# EAGLE design RoverWing-V2.0 (EAGLE 9.2.2)
Assembly variants: LCSC, DIGIKEY

## Sheet 1 of 2
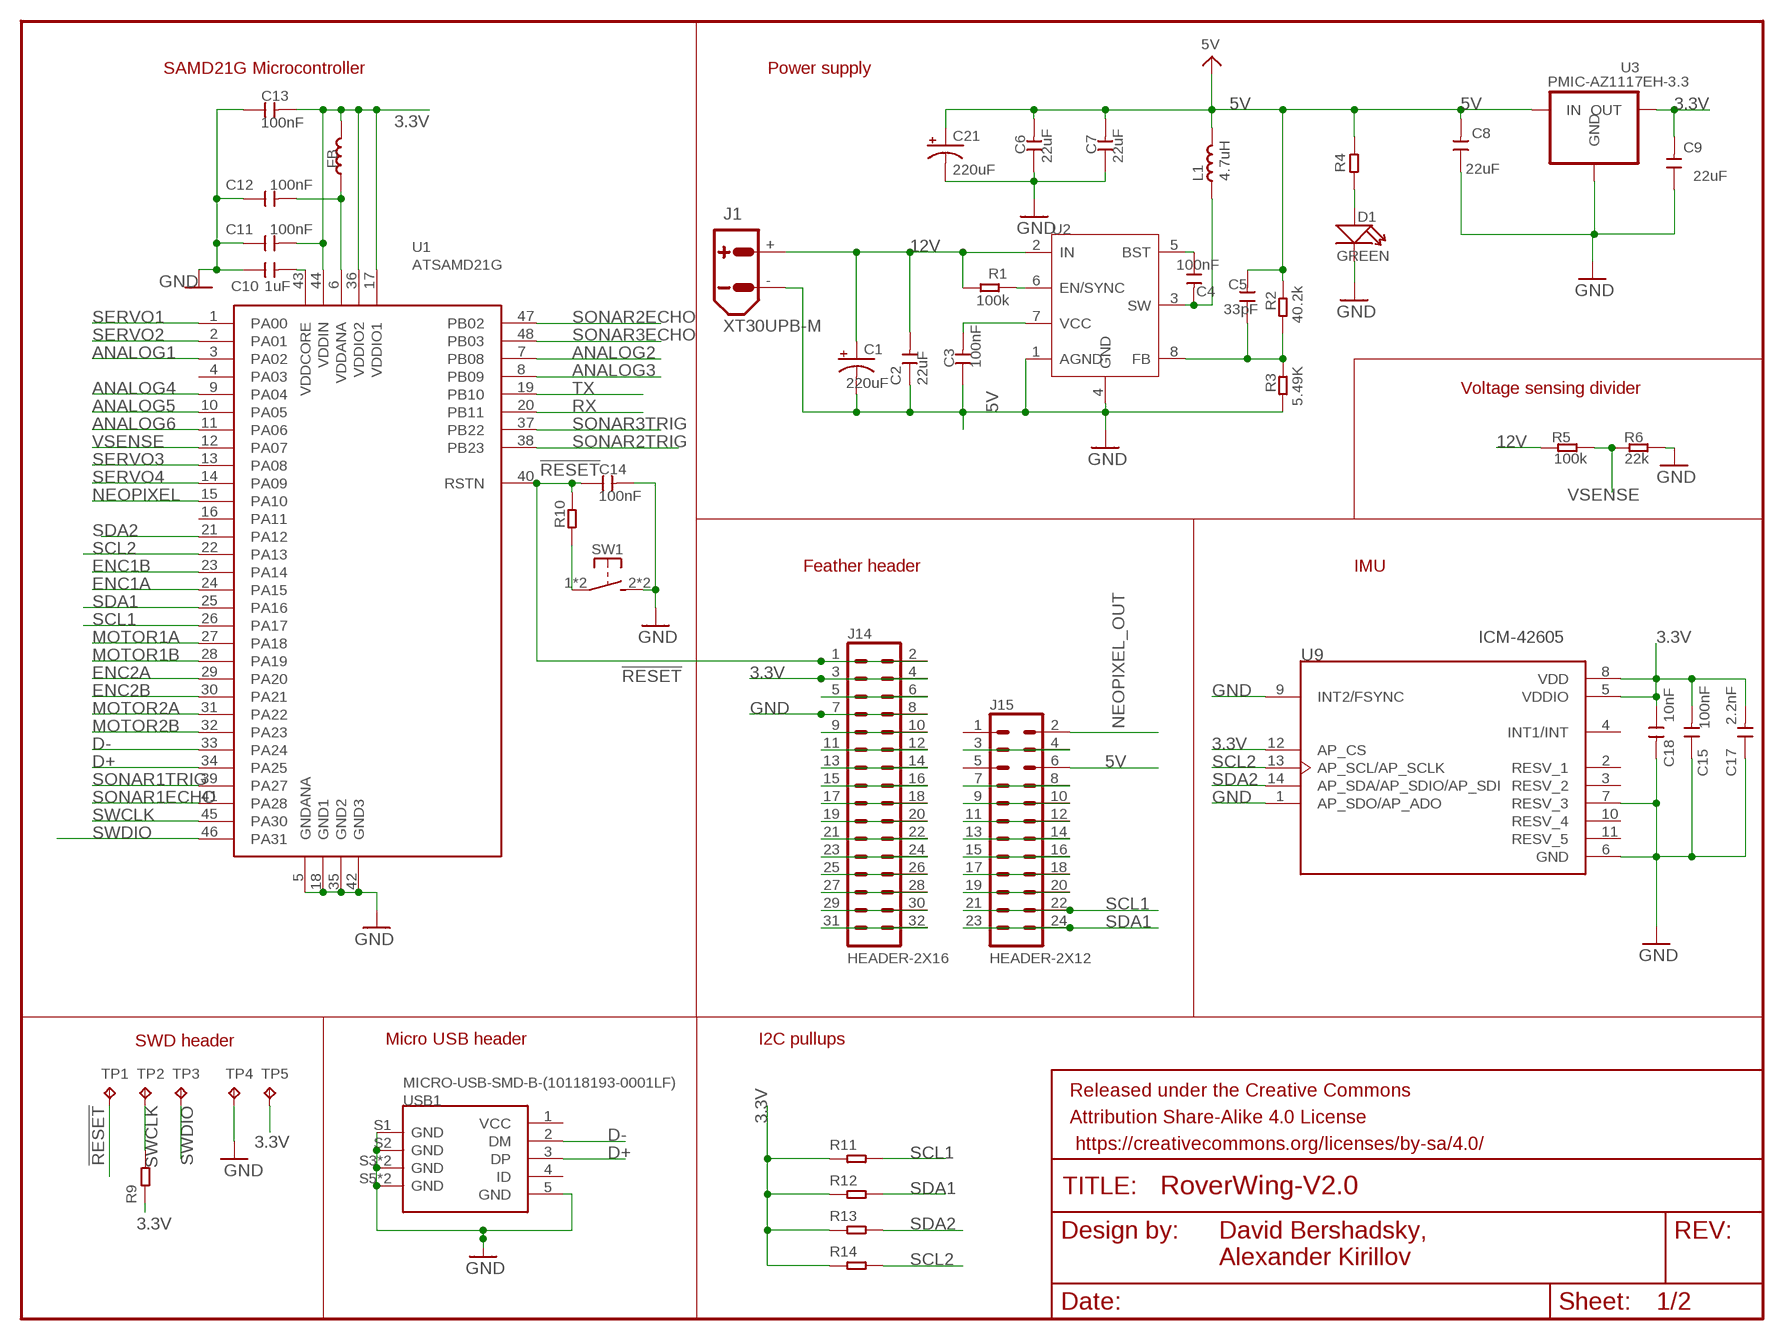
[diagram p0: schematic, sheet 1]

### Parts
C1  220uF  CAP-POL-SMD-8X10.5  [CAP-8X10.5]
C2  22uF  CAP-CERAMIC-SMD0805  [0805]
C3  100nF  CAP-CERAMIC-SMD0805  [0805]
C4  100nF  CAP-CERAMIC-SMD0805  [0805]
C5  33pF  CAP-CERAMIC-SMD0805  [0805]
C6  22uF  CAP-CERAMIC-SMD0805  [0805]
C7  22uF  CAP-CERAMIC-SMD0805  [0805]
C8  22uF  CAP-CERAMIC-SMD0805  [0805]
C9  22uF  CAP-CERAMIC-SMD0805  [0805]
C10  1uF  CAP-CERAMIC-SMD0805  [0805]
C11  100nF  CAP-CERAMIC-SMD0805  [0805]
C12  100nF  CAP-CERAMIC-SMD0805  [0805]
C13  100nF  CAP-CERAMIC-SMD0805  [0805]
C14  100nF  CAP-CERAMIC-SMD0805  [0805]
C15  100nF  CAP-CERAMIC-SMD0805  [0805]
C17  2.2nF  CAP-CERAMIC-SMD0805  [0805]
C18  10nF  CAP-CERAMIC-SMD0805  [0805]
C21  220uF  CAP-POL-SMD-8X10.5  [CAP-8X10.5]
D1  GREEN  SMD-LED-0805  [LED-0805]
FB  330R-1500MA  SMD-FERRITE-BEAD-330R-1500MA(0805)  [0805]
FRAME2  FRAME-LETTERNO_PACKAGE  [DUMMY]
J1  XT30UPB-M  [XT30UPB-M]
J14  HEADER-2X16  [2X16]
J15  HEADER-2X12  [2X12]
L1  4.7uH  IND-TDK-SPM6530T  [IND_TDK_7.1X6.5]
R1  100k  RES-SMD-0805  [0805]
R2  40.2k  RES-SMD-0805  [0805]
R3  5.49K  RES-SMD-0805  [0805]
R4  1K  SMD-RES-1.8K-1%-1/10W(0603)  [R0603]
R5  100k  RES-SMD-0805  [0805]
R6  22k  RES-SMD-0805  [0805]
R9  1K  SMD-RES-1.8K-1%-1/10W(0603)  [R0603]
R10  1K  SMD-RES-1.8K-1%-1/10W(0603)  [R0603]
R11  1.8K  SMD-RES-1.8K-1%-1/10W(0603)  [R0603]
R12  1.8K  SMD-RES-1.8K-1%-1/10W(0603)  [R0603]
R13  1.8K  SMD-RES-1.8K-1%-1/10W(0603)  [R0603]
R14  1.8K  SMD-RES-1.8K-1%-1/10W(0603)  [R0603]
SW1  SW-TACTILE-4.5X4.5_SMD  [TL3305]
TP1  TPTP15R  [TP15R]
TP2  TPTP15R  [TP15R]
TP3  TPTP15R  [TP15R]
TP4  TPTP15R  [TP15R]
TP5  TPTP15R  [TP15R]
U1  ATSAMD21G  [TQFP-48-EDITED]
U2  MP2225  PMIC-MP2225  [SOT-23-8]
U3  PMIC-AZ1117EH-3.3  [SOT223]
U9  ICM-42605  [PQFN50P300X250X97-14N]
USB1  MICRO-USB-SMD-B-(10118193-0001LF)  [MICRO-USB5+6P-SMD-0.65-B]

### Nets
3.3V: C9.2 C11.2 C13.2 C15.2 C17.2 C18.1 FB.2 J14.3 J14.4 R9.1 R11.1 R12.1 R13.1 R14.1 TP5.TP U1.17(VDDIO1) U1.36(VDDIO2) U1.44(VDDIN) U3.2(OUT) U3.4(OUT) U9.5(VDDIO) U9.8(VDD) U9.12(AP_CS) ; also sheet 2
5V: C5.2 C6.2 C7.2 C8.2 C21.+ J15.6 L1.2 R2.1 R4.2 U3.3(IN) ; also sheet 2
12V: C1.+ C2.2 J1.+ R1.2 R5.2 U2.2(IN) ; also sheet 2
!RESET: C14.1 J14.1 J14.2 R10.2 TP1.TP U1.40(RSTN)
ANALOG1: U1.3(PA02) ; also sheet 2
ANALOG2: U1.7(PB08) ; also sheet 2
ANALOG3: U1.8(PB09) ; also sheet 2
ANALOG4: U1.9(PA04) ; also sheet 2
ANALOG5: U1.10(PA05) ; also sheet 2
ANALOG6: U1.11(PA06) ; also sheet 2
BST: C4.1 U2.5(BST)
D+: U1.34(PA25) USB1.3(DP)
D-: U1.33(PA24) USB1.2(DM)
ENC1A: U1.24(PA15) ; also sheet 2
ENC1B: U1.23(PA14) ; also sheet 2
ENC2A: U1.29(PA20) ; also sheet 2
ENC2B: U1.30(PA21) ; also sheet 2
FB: C5.1 R2.2 R3.1 U2.8(FB)
GND: C1.- C2.1 C3.1 C6.1 C7.1 C8.1 C9.1 C10.1 C11.1 C12.1 C13.1 C14.2 C15.1 C17.1 C18.2 C21.- D1.- J1.- J14.7 J14.8 R3.2 R6.2 SW1.2(S1) SW1.3(S1) TP4.TP U1.5(GNDANA) U1.18(GND1) U1.35(GND2) U1.42(GND3) U2.1(AGND) U2.4(GND) U3.1(GND) U9.1(AP_SDO/AP_ADO) U9.6(GND) U9.7(RESV_3) U9.9(INT2/FSYNC) USB1.5(GND) USB1.S1(GND) USB1.S2(GND) USB1.S3(GND) USB1.S4(GND) USB1.S5(GND) USB1.S6(GND) ; also sheet 2
MOTOR1A: U1.27(PA18) ; also sheet 2
MOTOR1B: U1.28(PA19) ; also sheet 2
MOTOR2A: U1.31(PA22) ; also sheet 2
MOTOR2B: U1.32(PA23) ; also sheet 2
N$5: J15.3 J15.4
N$9: J15.7 J15.8
N$11: R10.1 SW1.1 SW1.4(P1)
N$12: J15.9 J15.10
N$14: C10.2 U1.43(VDDCORE)
N$15: J15.11 J15.12
N$17: D1.+ R4.1
N$18: J15.15 J15.16
N$22: J15.13 J15.14
N$23: R1.1 U2.6(EN/SYNC)
N$29: C3.2 U2.7(VCC)
N$42: J14.5 J14.6
N$45: J15.17 J15.18
N$46: J15.19 J15.20
N$48: J14.9 J14.10
N$49: J14.11 J14.12
N$50: J14.13 J14.14
N$51: J14.15 J14.16
N$52: J14.17 J14.18
N$53: J14.19 J14.20
N$54: J14.21 J14.22
N$55: J14.23 J14.24
N$56: J14.25 J14.26
N$57: J14.27 J14.28
N$58: J14.29 J14.30
N$59: J14.31 J14.32
NEOPIXEL: U1.15(PA10) ; also sheet 2
NEOPIXEL_OUT: J15.2 ; also sheet 2
RX: U1.20(PB11) ; also sheet 2
SCL1: J15.21 J15.22 R11.2 U1.26(PA17) ; also sheet 2
SCL2: R14.2 U1.22(PA13) U9.13(AP_SCL/AP_SCLK) ; also sheet 2
SDA1: J15.23 J15.24 R12.2 U1.25(PA16) ; also sheet 2
SDA2: R13.2 U1.21(PA12) U9.14(AP_SDA/AP_SDIO/AP_SDI) ; also sheet 2
SERVO1: U1.1(PA00) ; also sheet 2
SERVO2: U1.2(PA01) ; also sheet 2
SERVO3: U1.13(PA08) ; also sheet 2
SERVO4: U1.14(PA09) ; also sheet 2
SONAR1ECHO: U1.41(PA28) ; also sheet 2
SONAR1TRIG: U1.39(PA27) ; also sheet 2
SONAR2ECHO: U1.47(PB02) ; also sheet 2
SONAR2TRIG: U1.38(PB23) ; also sheet 2
SONAR3ECHO: U1.48(PB03) ; also sheet 2
SONAR3TRIG: U1.37(PB22) ; also sheet 2
SW: C4.2 L1.1 U2.3(SW)
SWCLK: R9.2 TP2.TP U1.45(PA30)
SWDIO: TP3.TP U1.46(PA31)
TX: U1.19(PB10) ; also sheet 2
VDDANA: C12.2 FB.1 U1.6(VDDANA)
VSENSE: R5.1 R6.1 U1.12(PA07)
Unconnected: J15.1 J15.5 U1.4(PA03) U1.16(PA11) U9.2(RESV_1) U9.3(RESV_2) U9.4(INT1/INT) U9.10(RESV_4) U9.11(RESV_5) USB1.1(VCC) USB1.4(ID)

### Notes on the sheet
- SAMD21G Microcontroller | Power supply
- Voltage sensing divider
- Feather header | IMU
- SWD header
- Micro USB header | I2C pullups
- David Bershadsky, 
  Alexander Kirillov

## Sheet 2 of 2
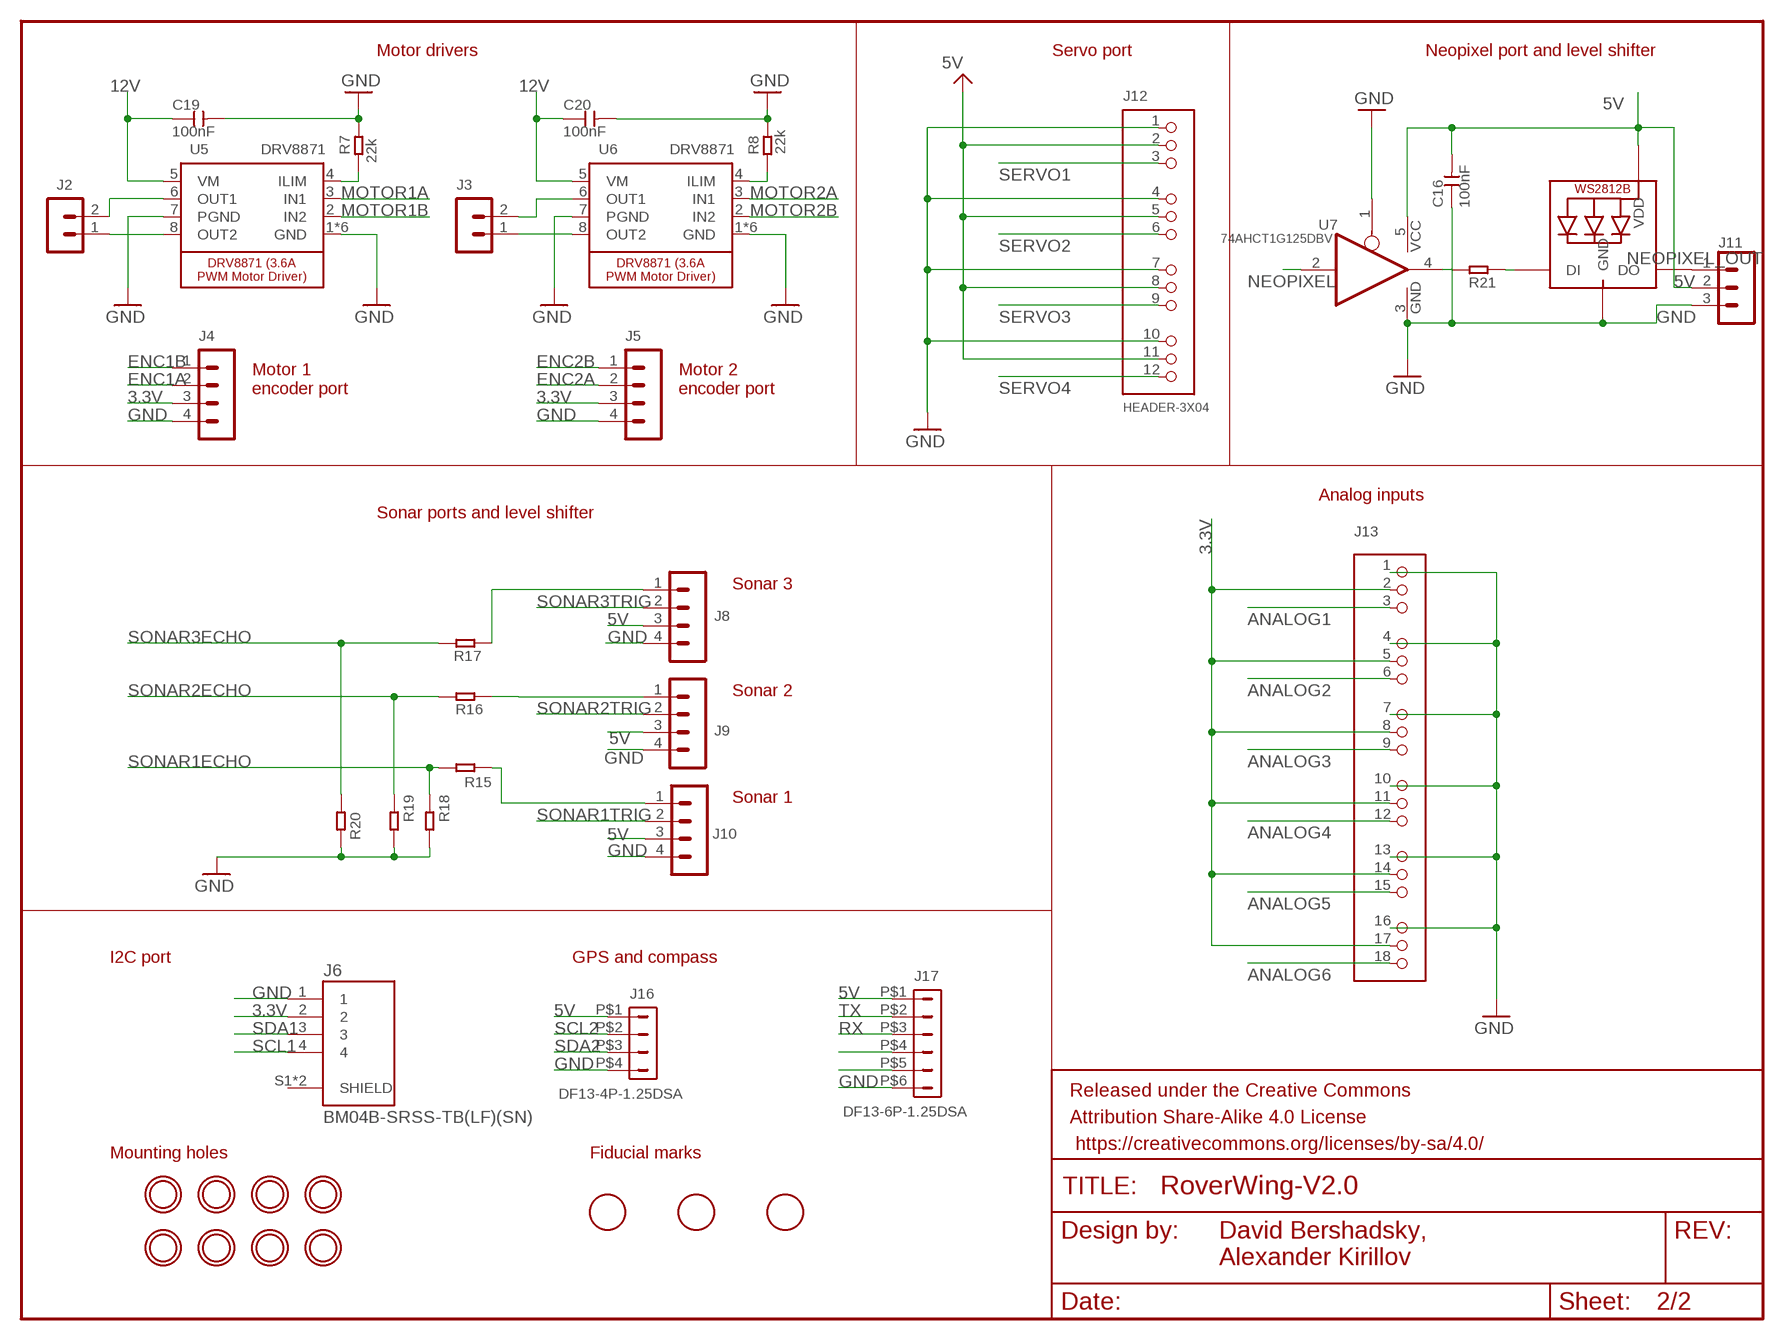
[diagram p1: schematic, sheet 2]

### Parts
C16  100nF  CAP-CERAMIC-SMD0805  [0805]
C19  100nF  CAP-CERAMIC-SMD0805  [0805]
C20  100nF  CAP-CERAMIC-SMD0805  [0805]
D2  WS2812B3535  [LED3535]
FRAME1  FRAME-LETTERNO_PACKAGE  [DUMMY]
J2  HEADER-VH  [B2P-VH]
J3  HEADER-VH  [B2P-VH]
J4  HEADER-PH-4P  [B4B-PH-K]
J5  HEADER-PH-4P  [B4B-PH-K]
J6  BM04B-SRSS-TB(LF)(SN)  [CONN_BM04B-SRSS-TB(LF)(SN)]
J8  HEADER-PH-4P  [B4B-PH-K]
J9  HEADER-PH-4P  [B4B-PH-K]
J10  HEADER-PH-4P  [B4B-PH-K]
J11  HEADER-PH-3P  [B3B-PH-K]
J12  HEADER-3X04  [3X04]
J13  HEADER-3X06"  [3X06]
J16  DF13-4P-1.25DSA  [DF13-4P-1.25DSA]
J17  DF13-6P-1.25DSA  [DF13-6P-1.25DSA]
R7  22k  RES-SMD-0805  [0805]
R8  22k  RES-SMD-0805  [0805]
R15  1K  SMD-RES-1.8K-1%-1/10W(0603)  [R0603]
R16  1K  SMD-RES-1.8K-1%-1/10W(0603)  [R0603]
R17  1K  SMD-RES-1.8K-1%-1/10W(0603)  [R0603]
R18  1.8K  SMD-RES-1.8K-1%-1/10W(0603)  [R0603]
R19  1.8K  SMD-RES-1.8K-1%-1/10W(0603)  [R0603]
R20  1.8K  SMD-RES-1.8K-1%-1/10W(0603)  [R0603]
R21  330  SMD-RES-1.8K-1%-1/10W(0603)  [R0603]
U5  DRV8871  [HSOP8]
U6  DRV8871  [HSOP8]
U7  74AHCT1G125DBV  [SOT23-5]
U$3  MOUNTINGHOLE3.0_NPH  [MOUNTINGHOLE_3.0_NPH]
U$4  MOUNTINGHOLE3.0_NPH  [MOUNTINGHOLE_3.0_NPH]
U$11  FIDUCIAL  [FIDUCIAL_1MM]
U$13  FIDUCIAL  [FIDUCIAL_1MM]
U$14  MOUNTINGHOLE3.0_NPH  [MOUNTINGHOLE_3.0_NPH]
U$15  MOUNTINGHOLE3.0_NPH  [MOUNTINGHOLE_3.0_NPH]
U$17  FIDUCIAL  [FIDUCIAL_1MM]
U$24  MOUNTINGHOLE3.0_NPH  [MOUNTINGHOLE_3.0_NPH]
U$25  MOUNTINGHOLE3.0_NPH  [MOUNTINGHOLE_3.0_NPH]
U$26  MOUNTINGHOLE3.0_NPH  [MOUNTINGHOLE_3.0_NPH]
U$27  MOUNTINGHOLE3.0_NPH  [MOUNTINGHOLE_3.0_NPH]

### Nets
3.3V: J4.3 J5.3 J6.2 J13.2 J13.5 J13.8 J13.11 J13.14 J13.17 ; also sheet 1
5V: C16.2 D2.3(VDD) J8.3 J9.3 J10.3 J11.2 J12.2 J12.5 J12.8 J12.11 J16.P$1 J17.P$1 U7.5(VCC) ; also sheet 1
12V: C19.1 C20.1 U5.5(VM) U6.5(VM) ; also sheet 1
ANALOG1: J13.3 ; also sheet 1
ANALOG2: J13.6 ; also sheet 1
ANALOG3: J13.9 ; also sheet 1
ANALOG4: J13.12 ; also sheet 1
ANALOG5: J13.15 ; also sheet 1
ANALOG6: J13.18 ; also sheet 1
ENC1A: J4.2 ; also sheet 1
ENC1B: J4.1 ; also sheet 1
ENC2A: J5.2 ; also sheet 1
ENC2B: J5.1 ; also sheet 1
GND: C16.1 C19.2 C20.2 D2.1(GND) J4.4 J5.4 J6.1 J8.4 J9.4 J10.4 J11.3 J12.1 J12.4 J12.7 J12.10 J13.1 J13.4 J13.7 J13.10 J13.13 J13.16 J16.P$4 J17.P$6 R7.2 R8.2 R18.2 R19.2 R20.2 U5.1(GND) U5.7(PGND) U5.GND U5.P$1(GND) U5.P$2(GND) U5.P$3(GND) U5.P$4(GND) U6.1(GND) U6.7(PGND) U6.GND U6.P$1(GND) U6.P$2(GND) U6.P$3(GND) U6.P$4(GND) U7.1(OE) U7.3(GND) ; also sheet 1
MOTOR1A: U5.3(IN1) ; also sheet 1
MOTOR1B: U5.2(IN2) ; also sheet 1
MOTOR2A: U6.3(IN1) ; also sheet 1
MOTOR2B: U6.2(IN2) ; also sheet 1
N$1: J3.1 U6.8(OUT2)
N$2: J3.2 U6.6(OUT1)
N$3: J2.1 U5.8(OUT2)
N$4: R21.2 U7.4(O)
N$6: D2.2(DI) R21.1
N$7: J10.1 R15.1
N$10: J8.1 R17.1
N$16: J2.2 U5.6(OUT1)
N$19: R7.1 U5.4(ILIM)
N$20: R8.1 U6.4(ILIM)
N$21: J9.1 R16.1
N$26: J17.P$4
N$27: J17.P$5
NEOPIXEL: U7.2(I) ; also sheet 1
NEOPIXEL_OUT: D2.4(DO) J11.1 ; also sheet 1
RX: J17.P$3 ; also sheet 1
SCL1: J6.4 ; also sheet 1
SCL2: J16.P$2 ; also sheet 1
SDA1: J6.3 ; also sheet 1
SDA2: J16.P$3 ; also sheet 1
SERVO1: J12.3 ; also sheet 1
SERVO2: J12.6 ; also sheet 1
SERVO3: J12.9 ; also sheet 1
SERVO4: J12.12 ; also sheet 1
SONAR1ECHO: R15.2 R18.1 ; also sheet 1
SONAR1TRIG: J10.2 ; also sheet 1
SONAR2ECHO: R16.2 R19.1 ; also sheet 1
SONAR2TRIG: J9.2 ; also sheet 1
SONAR3ECHO: R17.2 R20.1 ; also sheet 1
SONAR3TRIG: J8.2 ; also sheet 1
TX: J17.P$2 ; also sheet 1
Unconnected: J6.S1(SHIELD) J6.S2(SHIELD)

### Notes on the sheet
- Motor drivers | Servo port | Neopixel port and level shifter
- Motor 1
  encoder port
- Motor 2 
  encoder port
- Analog inputs
- Sonar ports and level shifter
- Sonar 3
- Sonar 2
- Sonar 1
- I2C port | GPS and compass
- Mounting holes | Fiducial marks
- David Bershadsky, 
  Alexander Kirillov

## Library data of the parts
C1 C21 = RoverWing-V1.5:CAP-POL-SMD-8X10.5: AL CAPACITOR, SMD 8x10.5 mm; MANUFACTURER: Semtech; PARTNO: CK1V221MCRF10
C2-C20 = RoverWing-V1.5:CAP-CERAMIC-SMD: CAP CERAMIC, SMD
D1 = RoverWing-V1.5:SMD-LED-0805: SMD LED, 0805; MANUFACTURER: LITE-ON; PARTNO: LTST-C170KGKT
D2 = RoverWing-V1.5:WS2812B: SMART LED, 3.5MM; MANUFACTURER: Worldsemi; PARTNO: WS2812B-3535
FB = RoverWing-V1.5:SMD-FERRITE-BEAD-330R-1500MA(0805): Ferrite Bead 330R, 1500 MA; MANUFACTURER: MURATA ELECTRONICS; PARTNO: BLM21PG331SN1D
FRAME1 FRAME2 = RoverWing-V1.5:FRAME-LETTER: Schematic Frame - Letter Standard 8.5x11 US Letter frame; BOM: EXCLUDE
J1 = RoverWing-V1.5:XT30: AMASS XT30 connector Store in Japan AMASS XT30 connector <https://szc.jp/ams-xt30>
J2 J3 = RoverWing-V1.5:HEADER-VH: HEADER - JST VH, 2P 3.96mm pitch; PARTNO: B2P-VH(LF)(SN)
J4 J5 J8-J10 = RoverWing-V1.5:HEADER-PH-4P: HEADER, JST PH, 4POS, THROUGH HOLE, STRAIGHT; MANUFACTURER: JST; PARTNO: B4B-PH-K-S(LF)(SN)
J6 = RoverWing-V1.5:BM04B-SRSS-TB(LF)(SN): HEADER, JST SH 4POS SMD STRAIGHT; MANUFACTURER: JST; PARTNO: BM04B-SRSS-TB_LF__SN_
J11 = RoverWing-V1.5:HEADER-PH-3P: HEADER, JST PH, 3POS, THROUGH HOLE, STRAIGHT; MANUFACTURER: JST; PARTNO: B3B-PH-K-S(LF)(SN)
J12 = RoverWing-V1.5:HEADER-3X04
J13 = RoverWing-V1.5:HEADER-3X06
J14 = RoverWing-V1.5:HEADER-2X16: HEADER - 2x16, 0.1" PITCH
J15 = RoverWing-V1.5:HEADER-2X12: HEADER, 2x12, 0.1" PITCH
J16 = RoverWing-V1.5:DF13-4P-1.25: DF13-4P 1.25mm Pitch Miniature Crimping Connector.; PARTNO: DF13-4P-1.25DSA
J17 = RoverWing-V1.5:DF13-6P-1.25: DF13-6P 1.25mm Pitch Miniature Crimping Connector.; PARTNO: DF13-6P-1.25DSA
L1 = RoverWing-V1.5:IND-TDK-SPM6530T: Power inductor, SMD, 4.7uH, 5.2A Manufacturer: TDK; MANUFACTURER: TDK; PARTNO: SPM6530T-4R7M
R1-R3 R5-R8 = RoverWing-V1.5:RES-SMD-0805
R4 R9-R21 = RoverWing-V1.5:SMD-RES-1.8K-1%-1/10W(0603): SMD RESISTOR, 0603
SW1 = RoverWing-V1.5:SW-TACTILE: Tactile Switche; MANUFACTURER: BRIGHT; PARTNO: TSA453G38-250
TP1-TP5 = RoverWing-V1.5:TP: Test pad; BOM: EXCLUDE
U1 = RoverWing-V1.5:ATSAMD21G: SAMD21G MCU ARM® Cortex®-M0+ SAM D21G Microcontroller by Microchip Technology Specs: 32 bits 48 Mhz frequency 256 KB flash memory, 32 KB RAM Package: TQFP48 MPN: ATSAMD21G18A-AU; MANUFACTURER: Microchip Technology; PARTNO: ATSAMD21G18A-AU
U2 = RoverWing-V1.5:PMIC-MP2225: MP2225 buck converter Manufacturer: Monolithic Power Systems Specs: Vin: 4.5-18 V Vout: up to 13.7 V Iout: up to 5A; MANUFACTURER: Monolithic Power Systems; PARTNO: MP2225GJ
U3 = RoverWing-V1.5:PMIC-AZ1117EH-*: LDO VOLTAGE REGULATOR; MANUFACTURER: DIODES INC; PARTNO: AZ1117EH-3.3TRG1
U5 U6 = RoverWing-V1.5:DRV8871: DRV8871 - 3.6A PWM Motor Driver; MANUFACTURER: TEXAS INSTRUMENTS; PARTNO: DRV8871DDAR; SIZE: HSOP8
U7 = RoverWing-V1.5:74*1G125: Single Bus Buffer Gate with 3-State Output; PARTNO: SN74AHCT1G125DBVR
U9 = RoverWing-V1.5:ICM-42605: Single-Interface MotionTracking device The ICM-42605 is a 6-axis MotionTracking device that combines a 3-axis gyroscope, and a 3-axis accelerometer in a small 2.5x3x0.91 mm (14-pin LGA) package. It also features a 2K-byte FIFO that can lower the traffic on the serial bus interface, and reduce power consumption by allowing the system processor to burst read sensor data and then go into a low-power mode.; MANUFACTURER: TDK InvenSense; PARTNO: ICM-42605
U$3 U$4 U$14 U$15 U$24-U$27 = RoverWing-V1.5:MOUNTINGHOLE: Mounting Hole For #2 screws (0.086"/2.18mm width, 0.094"/2.4mm hole) use 2.5mm; BOM: EXCLUDE
U$11 U$13 U$17 = RoverWing-V1.5:FIDUCIAL: For use by pick and place machines to calibrate the vision/machine, 1mm By microbuilder.eu; BOM: EXCLUDE
USB1 = RoverWing-V1.5:MICRO-USB-SMD-B-(10118193-0001LF): 320010003; MANUFACTURER: Amphenol ICC; PARTNO: 10118193-0001LF

## Net classes
1 thinpower: width 0.305 mm
2 thickpower: width 0.406 mm

## Board
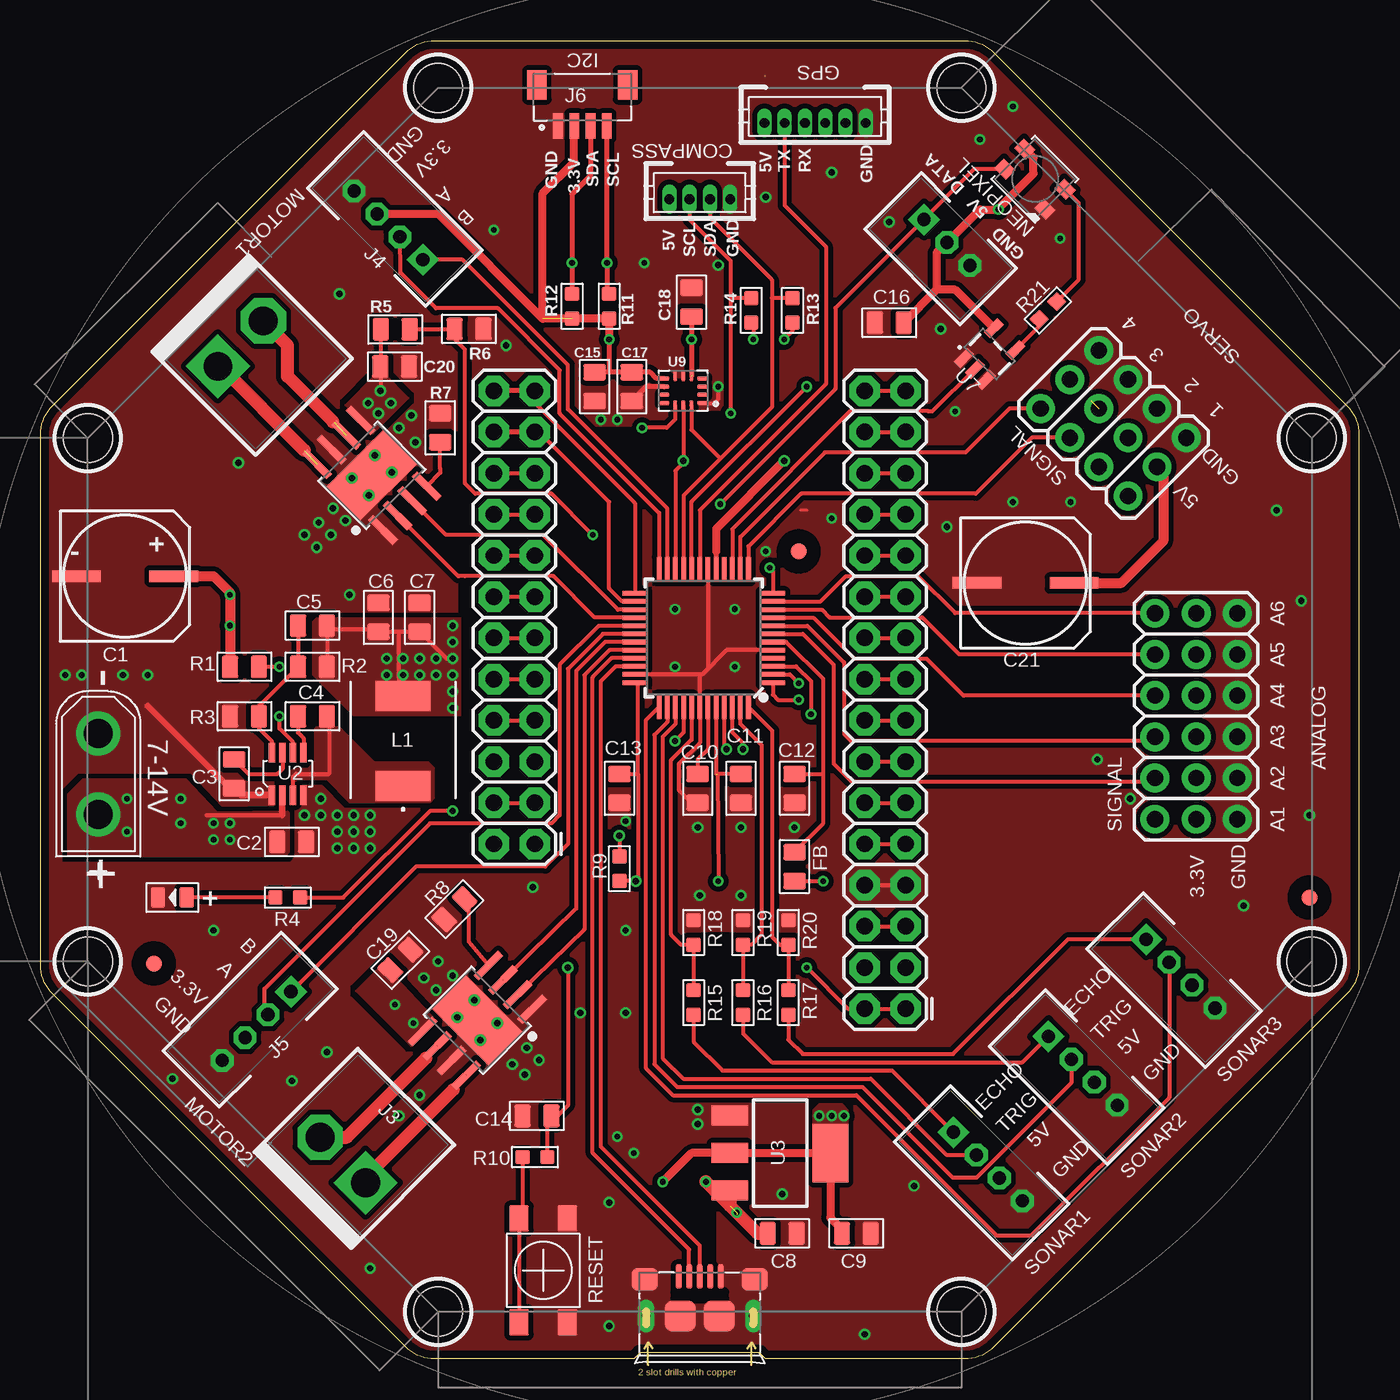
[diagram p2: board, top side]
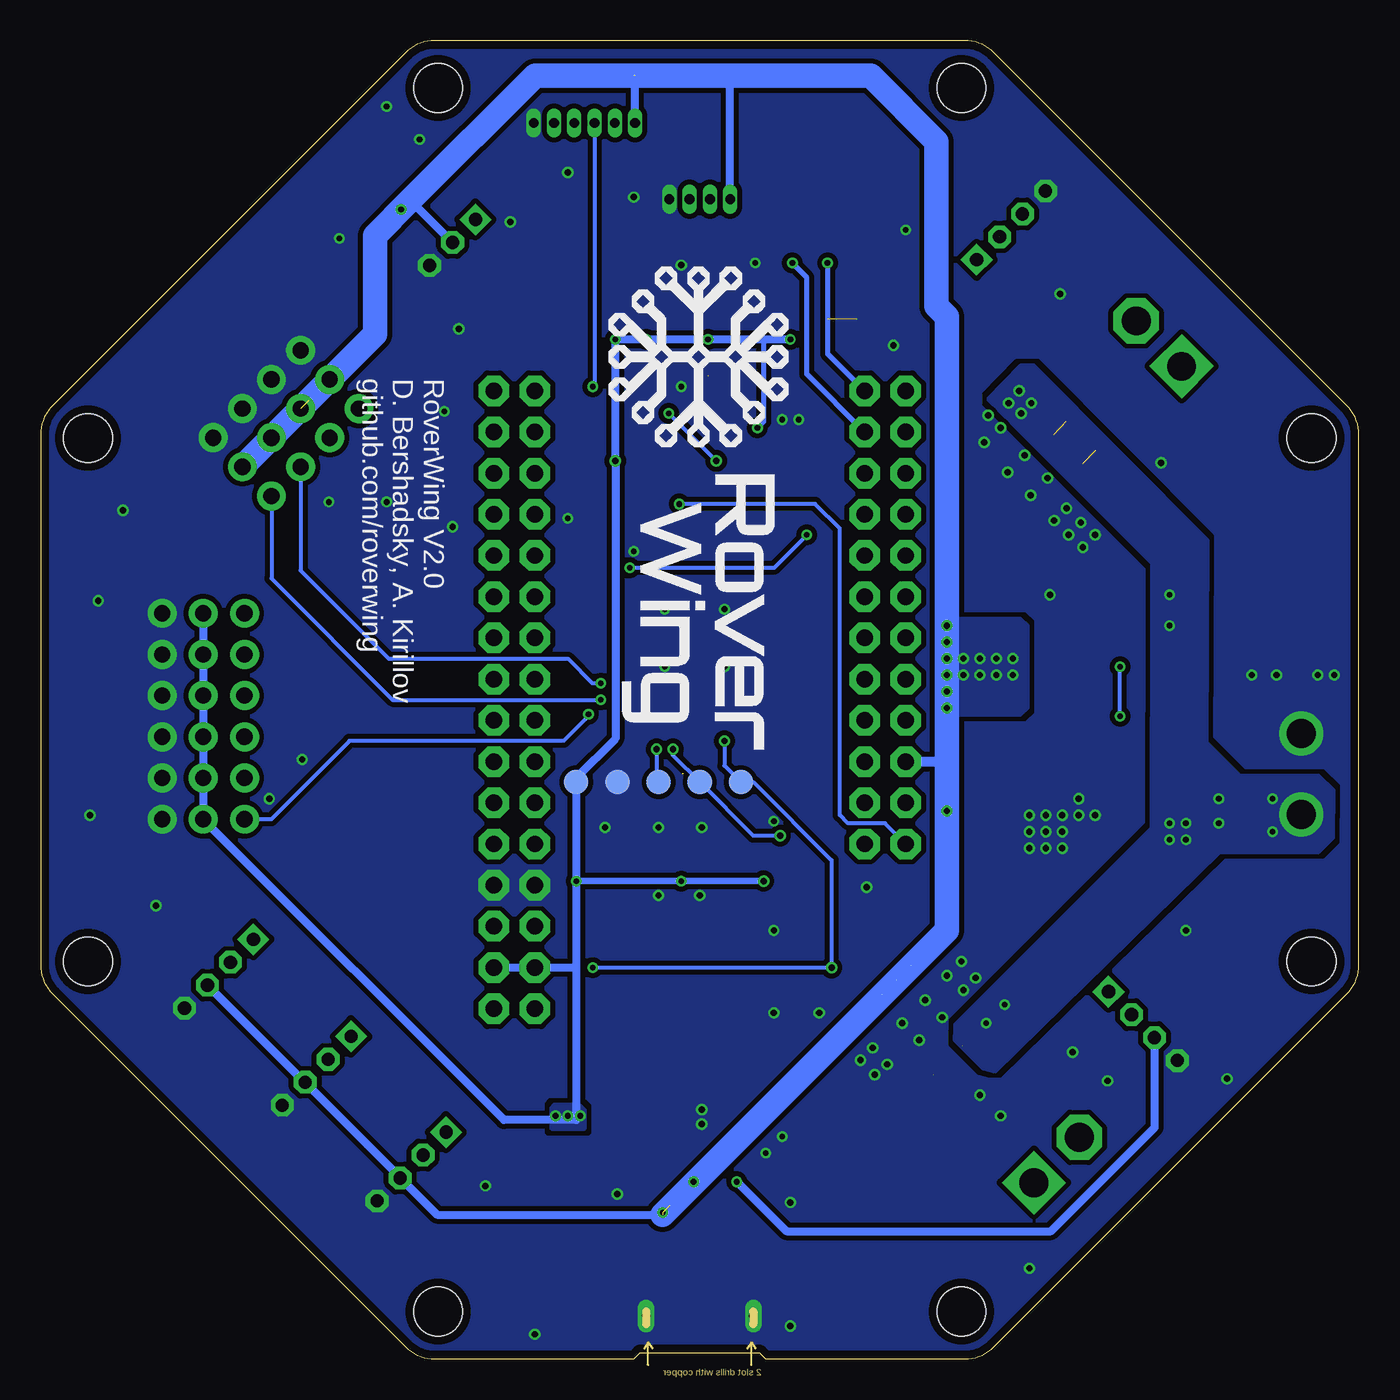
[diagram p3: board, bottom side, seen from below]

Size 81.28 x 81.28 mm. Coordinates in mm from the lower left corner, seen from the top.
Outline: 0,24.29 0,56.99 arc-45 0.74,58.78 22.5,80.54 arc-45 24.29,81.28 56.99,81.28 arc-45 58.78,80.54 80.54,58.78 arc-45 81.28,56.99 81.28,24.29 arc-45 80.54,22.5 58.78,0.74 arc-45 56.99,0 44.7,0 44.32,0.38 36.96,0.38 36.58,0 24.29,0 arc-45 22.5,0.74 0.74,22.5 arc-45 0,24.29
Copper layers (1*16): Top 0.035mm / dielectric 1.6mm / Bottom 0.035mm
Design rules "Elecrow_2-layer_PCB_eagle_rule": minimum track width 6mil, minimum drill 12mil, track to track 6mil, track to pad 6mil, pad to pad 6mil, via to via 8mil, smd to smd 0mil, copper to edge 20mil, drill to drill 10mil, minimum pad ring 6mil, minimum via ring 6mil, stop-mask expansion 0mil, vias tented up to drill 100mil, thermal gap 10mil

### Footprints (pad centres in the part's own frame; a part is rotated, then mirrored left to right if it is on the bottom)
CAP-8X10.5 = smd 3 x 0.7: + -3,0; - 3,0
0805 = smd 1.016 x 1.397: 1 -0.889,0; 2 0.889,0
LED-0805 = smd 0.889 x 1.27: + -0.889,0; - 0.889,0
LED3535 = smd 1 x 0.85: 1 -1.75,0.875; 2 -1.75,-0.875; 3 1.75,-0.875; 4 1.75,0.875
XT30UPB-M = drill 1.8: + 2.5,0; - -2.5,0
B2P-VH = drill 1.778 pad 2.794 square: 1 -1.98,0 | drill 1.778 pad 2.794 octagon: 2 1.98,0
B4B-PH-K = drill 0.813 pad 1.397 square: 1 3,0 | drill 0.813 pad 1.397 octagon: 2 1,0; 3 -1,0; 4 -3,0
CONN_BM04B-SRSS-TB(LF)(SN) = smd 0.6 x 1.55: 1 -1.5,-1.325; 2 -0.5,-1.325; 3 0.5,-1.325; 4 1.5,-1.325 | smd 1.2 x 1.8: S1 -2.8,1.2; S2 2.8,1.2
B3B-PH-K = drill 0.813 pad 1.397 square: 1 2,0 | drill 0.813 pad 1.397 octagon: 2 0,0; 3 -2,0
3X04 = drill 1 pad 1.778: 1 -3.81,-2.54; 2 -3.81,0; 3 -3.81,2.54; 4 -1.27,-2.54; 5 -1.27,0; 6 -1.27,2.54; 7 1.27,-2.54; 8 1.27,0; 9 1.27,2.54; 10 3.81,-2.54; 11 3.81,0; 12 3.81,2.54
3X06 = drill 1 pad 1.778: 1 -6.35,-2.54; 2 -6.35,0; 3 -6.35,2.54; 4 -3.81,-2.54; 5 -3.81,0; 6 -3.81,2.54; 7 -1.27,-2.54; 8 -1.27,0; 9 -1.27,2.54; 10 1.27,-2.54; 11 1.27,0; 12 1.27,2.54; 13 3.81,-2.54; 14 3.81,0; 15 3.81,2.54; 16 6.35,-2.54; 17 6.35,0; 18 6.35,2.54
2X16 = drill 1.016 pad 1.88 octagon: 1 0,0; 2 0,2.54; 3 2.54,0; 4 2.54,2.54; 5 5.08,0; 6 5.08,2.54; 7 7.62,0; 8 7.62,2.54; 9 10.16,0; 10 10.16,2.54; 11 12.7,0; 12 12.7,2.54; 13 15.24,0; 14 15.24,2.54; 15 17.78,0; 16 17.78,2.54; 17 20.32,0; 18 20.32,2.54; 19 22.86,0; 20 22.86,2.54; 21 25.4,0; 22 25.4,2.54; 23 27.94,0; 24 27.94,2.54; 25 30.48,0; 26 30.48,2.54; 27 33.02,0; 28 33.02,2.54; 29 35.56,0; 30 35.56,2.54; 31 38.1,0; 32 38.1,2.54
2X12 = drill 1.016 pad 1.88 octagon: 1 0,0; 2 0,2.54; 3 2.54,0; 4 2.54,2.54; 5 5.08,0; 6 5.08,2.54; 7 7.62,0; 8 7.62,2.54; 9 10.16,0; 10 10.16,2.54; 11 12.7,0; 12 12.7,2.54; 13 15.24,0; 14 15.24,2.54; 15 17.78,0; 16 17.78,2.54; 17 20.32,0; 18 20.32,2.54; 19 22.86,0; 20 22.86,2.54; 21 25.4,0; 22 25.4,2.54; 23 27.94,0; 24 27.94,2.54
DF13-4P-1.25DSA = drill 0.6 pad 0.8 long: P$1 1.875,0; P$2 0.625,0; P$3 -0.625,0; P$4 -1.875,0
DF13-6P-1.25DSA = drill 0.6 pad 0.9 long: P$1 3.125,0; P$2 1.875,0; P$3 0.625,0; P$4 -0.625,0; P$5 -1.875,0; P$6 -3.125,0
IND_TDK_7.1X6.5 = smd 1.85 x 3.4: 1 -2.775,0; 2 2.775,0
R0603 = smd 0.889 x 0.889: 1 0,0.762; 2 0,-0.762
TL3305 = smd 1.6 x 1.2: 1 -3.2,1.5; 2 -3.2,-1.5; 3 3.2,-1.5; 4 3.2,1.5
TP15R = smd 1.5 x 1.5: TP 0,0
TQFP-48-EDITED = smd 1.5 x 0.28: 1 -4.25,2.75; 2 -4.25,2.25; 3 -4.25,1.75; 4 -4.25,1.25; 5 -4.25,0.75; 6 -4.25,0.25; 7 -4.25,-0.25; 8 -4.25,-0.75; 9 -4.25,-1.25; 10 -4.25,-1.75; 11 -4.25,-2.25; 12 -4.25,-2.75; 25 4.25,-2.75; 26 4.25,-2.25; 27 4.25,-1.75; 28 4.25,-1.25; 29 4.25,-0.75; 30 4.25,-0.25; 31 4.25,0.25; 32 4.25,0.75; 33 4.25,1.25; 34 4.25,1.75; 35 4.25,2.25; 36 4.25,2.75 | smd 0.28 x 1.5: 13 -2.75,-4.25; 14 -2.25,-4.25; 15 -1.75,-4.25; 16 -1.25,-4.25; 17 -0.75,-4.25; 18 -0.25,-4.25; 19 0.25,-4.25; 20 0.75,-4.25; 21 1.25,-4.25; 22 1.75,-4.25; 23 2.25,-4.25; 24 2.75,-4.25; 37 2.75,4.25; 38 2.25,4.25; 39 1.75,4.25; 40 1.25,4.25; 41 0.75,4.25; 42 0.25,4.25; 43 -0.25,4.25; 44 -0.75,4.25; 45 -1.25,4.25; 46 -1.75,4.25; 47 -2.25,4.25; 48 -2.75,4.25
SOT-23-8 = smd 0.4 x 1.2: 1 -0.975,-1.3; 2 -0.325,-1.3; 3 0.325,-1.3; 4 0.975,-1.3; 5 0.975,1.3; 6 0.325,1.3; 7 -0.325,1.3; 8 -0.975,1.3
SOT223 = smd 1.219 x 2.235: 1 -2.311,-3.099; 2 0,-3.099; 3 2.311,-3.099 | smd 3.6 x 2.2: 4 0,3.099
HSOP8 = smd 2.15 x 0.45: 1 -2.875,1.905; 2 -2.875,0.635; 3 -2.875,-0.635; 4 -2.875,-1.905; 5 2.875,-1.905; 6 2.875,-0.635; 7 2.875,0.635; 8 2.875,1.905 | smd 2.95 x 4.9: GND 0,0 | drill 0.4: P$1 0.75,1; P$2 -0.75,1; P$3 -0.75,-1; P$4 0.75,-1
SOT23-5 = smd 1.2 x 0.55: 1 -1.3,0.95; 2 -1.3,0; 3 -1.3,-0.95; 4 1.3,-0.95; 5 1.3,0.95
PQFN50P300X250X97-14N = smd 0.61 x 0.25: 1 -1.16,0.75; 2 -1.16,0.25; 3 -1.16,-0.25; 4 -1.16,-0.75; 8 1.16,-0.75; 9 1.16,-0.25; 10 1.16,0.25; 11 1.16,0.75 | smd 0.25 x 0.61: 5 -0.5,-0.91; 6 0,-0.91; 7 0.5,-0.91; 12 0.5,0.91; 13 0,0.91; 14 -0.5,0.91
MOUNTINGHOLE_3.0_NPH = hole 3: 0,0
FIDUCIAL_1MM = smd 1 x 1: 1 0,0
MICRO-USB5+6P-SMD-0.65-B = smd 0.4 x 1.5: 1 -1.3,-0.25; 2 -0.65,-0.25; 3 0,-0.25; 4 0.65,-0.25; 5 1.3,-0.25 | smd 1.6 x 1.4: S1 -3.4,-0.427; S6 3.4,-0.427 | drill 0.508 pad 1.016 long: S2 -3.3,-2.675; S5 3.3,-2.675 | smd 1.9 x 1.9: S3 -1.2,-2.675; S4 1.2,-2.675

### Placement (x,y rotation side)
C1  5.21,48.26 180 top
C2  15.49,31.88 180 top
C3  11.94,36.07 90 top
C4  16.76,39.62 0 top
C5  16.76,45.21 0 top
C6  20.83,45.72 270 top
C7  23.37,45.72 270 top
C8  45.72,7.75 180 top
C9  50.29,7.75 180 top
C10  40.51,35.18 90 top
C11  43.18,35.18 90 top
C12  46.48,35.18 90 top
C13  35.69,35.18 90 top
C14  30.61,14.99 180 top
C15  34.16,59.94 90 top
C16  52.32,63.88 0 top
C17  36.45,59.94 90 top
C18  40.13,65.15 90 top
C19  22.19,24.6 45 top
C20  21.83,61.18 0 top
C21  60.72,47.84 180 top
D1  8.13,28.45 180 top
D2  61.3,72.73 135 top
FB  46.48,30.35 270 top
FRAME1  76.84,81.15 0 top
FRAME2  77.85,82.17 0 top
J1  3.56,36.07 270 top
J2  12.33,62.6 45 top
J3  18.64,12.27 135 top
J4  21.45,69.89 315 top
J5  13.31,20.52 45 top
J6  33.4,77.34 0 top
J8  70.28,23.75 135 top
J9  64.26,17.76 135 top
J10  58.4,11.86 135 top
J11  55.88,68.83 135 top
J12  66.15,57.69 135 top
J13  71.25,39.62 90 top
J14  53.34,21.59 90 top
J15  30.48,31.75 90 top
J16  40.64,71.5 180 top
J17  47.75,76.2 180 top
L1  22.35,38.1 90 top
R1  12.57,42.67 180 top
R2  16.76,42.67 180 top
R3  12.57,39.62 180 top
R4  15.24,28.45 90 top
R5  21.87,63.48 180 top
R6  26.42,63.5 0 top
R7  24.64,57.4 90 top
R8  25.51,27.72 225 top
R9  35.69,30.23 180 top
R10  30.48,12.45 90 top
R11  35.05,64.9 180 top
R12  32.77,64.9 180 top
R13  46.36,64.64 180 top
R14  43.81,64.64 180 top
R15  40.26,21.97 180 top
R16  43.31,21.97 180 top
R17  46.1,21.97 180 top
R18  40.26,26.29 180 top
R19  43.31,26.29 180 top
R20  46.1,26.29 180 top
R21  62.1,64.64 315 top
SW1  30.99,5.46 90 top
TP1  38.1,35.56 0 bottom
TP2  40.64,35.56 0 bottom
TP3  43.18,35.56 0 bottom
TP4  45.72,35.56 0 bottom
TP5  48.26,35.56 0 bottom
U1  40.89,44.45 180 top
U2  15.24,36.07 0 top
U3  45.59,12.7 270 top
U5  20.43,54.48 135 top
U6  26.92,20.88 225 top
U7  58.52,61.95 45 top
U9  39.62,59.69 180 top
U$3  24.51,2.92 0 top
U$4  56.77,2.92 0 top
U$11  78.23,28.45 0 top
U$13  6.98,24.38 0 top
U$14  2.92,24.51 0 top
U$15  2.92,56.77 0 top
U$17  46.74,49.78 0 top
U$24  78.36,24.51 0 top
U$25  78.36,56.77 0 top
U$26  24.51,78.36 0 top
U$27  56.77,78.36 0 top
USB1  40.64,5.33 0 top

### Tracks (layer width: path | path; a pad name or v marks a point on that pad's centre or on a via)
3.3V  (via drill 0.35, 0.39)  (3 unrouted)
  Top 0.254: v48.26,29.46 FB.2 46.4,29.38 | C13.2 36.83,36.07 | 36.83,36.07 36.83,29.59 v36.7,29.46 R9.1 | 49.4,8 C9.2 | R14.1 43.94,63.75 v43.94,62.87 | R13.1 46.36,63.37 v45.85,62.87 | U1.36 36.83,41.51 36.83,36.07 | U1.44 41.64,36.07 | v41.78,29.46 41.74,36.07 C11.2 | U9.12 39.12,57.92 38.61,57.4 v37.08,57.4
  Top 0.305: 41.64,49.78 U1.17 | U9.8 37.98,60.44 37.59,60.83 C17.2 35.05,60.83 | 35.05,60.83 C15.2 | v35.05,62.87 35.05,60.83 | C18.1 v40.13,62.87 40.13,60.61
  Top 0.508: v45.85,55.37 41.64,51.17 41.64,49.78 | v38.35,10.92 40.13,12.7 U3.2 U3.4 48.69,8.71 49.4,8 | J4.3 24.5,70.59 30.96,64.14 | 30.96,64.14 R11.1 v35.05,62.87 | 30.96,64.14 30.96,71.86 32.9,73.8 J6.2
  Bottom 0.305: 36.7,62.87 36.7,57.78 v37.08,57.4
  Bottom 0.406: 48.26,35.81 TP5.TP | v48.26,29.46 v41.78,29.46 v36.7,29.46
  Bottom 0.508: 48.26,35.81 45.85,38.23 v45.85,55.37 v45.85,62.87 v43.94,62.87 v40.13,62.87 36.7,62.87 v35.05,62.87 | TP5.TP v48.26,29.46 48.26,24.13 | J13.17 J13.14 J13.11 J13.8 J13.5 J13.2 52.7,14.73 48.26,14.73 48.26,24.13 | J14.3 J14.4 48.26,24.13 | v38.35,10.92 35.31,7.87 18.98,7.87 12.61,14.25 J5.3
  other vias: 48.01,14.99 48.77,14.99 49.53,14.99
  pour Top (no thermals): 47.62,14.22 47.62,15.37 48.01,15.75 49.28,15.75 49.4,15.75 49.78,15.37 49.78,14.22
  pour Bottom (no thermals): 47.62,15.37 48.01,15.75 49.66,15.75 49.91,15.49 49.91,14.22 49.78,14.1 47.75,14.1 47.62,14.22
5V  (via drill 0.35, 0.39)  (4 unrouted)
  Top 0.254: C5.2 17.65,44.96 | 17.65,44.96 R2.1 | 22.1,44.83 C6.2 20.7,44.96 17.65,44.96 | 22.1,44.83 C7.2 25.02,43.18 v25.4,43.18 | 22.1,40.88 22.1,44.83 | v25.4,33.78 24,33.78 18.67,28.45 R4.2
  Top 0.406: U3.3 42.49,10.34
  Top 0.508: D2.3 61.21,74.06 61.21,73.09 59.05,70.93 v59.05,70.87 57.91,70.87 J11.2 55.25,68.2 55.25,65.91 | C16.2 55.25,65.91 | U7.5 56.4,65.91 55.25,65.91
  Top 0.61: C21.+ 66.64,47.84 69.22,50.42 69.22,54.62 J12.2
  Top 0.813: 42.49,9.45 U3.3 41.55,10.39 v41.02,10.92 42.49,9.45 | 42.49,9.45 44.2,7.75 C8.2
  Bottom 0.406: 65.01,17.06 J9.3 | 59.11,11.21 J10.3
  Bottom 0.508: J8.3 65.01,17.06 | J9.3 59.11,11.21 | J10.3 56.85,8.89 42.93,8.89 | J16.P$1 38.77,78.58 38.23,79.12 | J17.P$1 44.63,79.12 | J11.2 58.48,71.44
  Bottom 0.61: J15.6 25.4,36.83
  Bottom 1.524: 44.63,79.12 38.23,79.12 30.1,79.12 26.04,75.06 26.04,64.9 25.4,64.26 v25.4,44.2 v25.4,42.16 v25.4,41.15 v25.4,40.13 25.4,36.83 v25.4,33.78 25.4,26.42 42.93,8.89 | 44.7,79.12 50.8,79.12 58.48,71.44 60.66,69.26 60.66,63.18 J12.11 J12.8 | J12.2 J12.5 64.75,59.09
  other vias: 25.4,45.21 42.93,9.02 24.38,43.18 23.37,43.18 22.35,43.18 24.38,42.16 23.37,42.16 22.35,42.16 21.34,42.16 21.34,43.18
  pour Top (no thermals): 16.76,42.16 16.76,45.47 17.02,45.72 25.91,45.72 25.91,39.62 19.3,39.62
  pour Bottom (no thermals): 25.91,40.13 25.4,39.62 25.27,39.62 20.83,39.62 20.32,40.13 20.32,45.21 20.83,45.72 25.4,45.72 25.91,45.21
12V  (via drill 0.35, 0.39)
  Top 0.254: R5.2 20.98,59.71 v20.96,59.69 | 10.21,33.53 14.91,33.53
  Top 0.406: U2.2 14.91,33.53
  Top 0.61: C1.+ 10.67,48.26 11.68,47.24 v11.68,47.12 R1.2
  other vias: 20.19,58.93 21.84,21.84 22.99,20.7 20.83,58.29 21.59,58.93 11.68,45.21 10.67,33.02 10.67,32 11.68,32 11.68,33.02 8.64,33.02 8.64,34.54 5.33,32.51 5.33,34.54
  pour Bottom (isolate 0.254, no thermals): 20.1,61.24 9.38,50.45 9.44,37.97 7.41,35.94 2.49,35.94 1.61,35.07 1.64,32.15 2.55,31.24 8.62,31.24 22.45,17.72 23.13,17.93 24.89,19.69 24.89,19.94 24.86,19.97 24.86,20.61 12.73,32.71 12.7,46.48 12.7,49.06 22.83,59.19 20.81,61.24
  pour Top (no thermals): 18.8,58.8 20.7,60.71 21.21,60.71 22.67,59.25 20.51,57.09
  pour Top (no thermals): 24.38,20.83 22.86,19.3 19.46,22.7 21.11,24.35
  pour Top (no thermals): 15.37,33.66 15.24,33.79 10.9,33.73 8.99,35.75 2.6,35.75 1.65,34.8 1.65,30.99 15.11,30.99 15.37,31.24
!RESET  (via drill 0.35, 0.39)
  Top 0.254: v39.12,38.1 39.64,38.63 U1.40 | v32.51,24.13 32.51,15.62 31.88,14.99 31.62,14.99 | C14.1 31.62,14.99 | J14.1 J14.2 49.78,21.59 v47.24,24.13 | R10.2 31.24,14.61 31.62,14.99
  Bottom 0.254: v39.12,38.1 39.12,36.58 TP1.TP 37.34,35.56 32.51,30.73 v32.51,24.13 v47.24,24.13
ANALOG1  (via drill 0.35)
  Top 0.254: v47.5,39.75 47.5,41.78 46.58,42.7 U1.3
  Bottom 0.254: v47.5,39.75 47.5,39.62 49.02,38.1 62.23,38.1 67.06,33.27 J13.3
ANALOG2
  Top 0.254: J13.6 68.45,35.56 50.04,35.56 48.9,36.7 48.9,42.8 46.99,44.7 U1.7
ANALOG3
  Top 0.254: J13.9 68.45,38.1 49.97,38.1 49.53,38.54 49.53,42.95 47.28,45.2 U1.8
ANALOG4
  Top 0.254: J13.12 56.9,40.89 54.61,43.18 50.16,43.18 47.65,45.7 U1.9
ANALOG5
  Top 0.254: J13.15 56.64,43.43 54.36,45.72 48.64,45.72 48.16,46.2 U1.10
ANALOG6
  Top 0.254: J13.18 56.39,45.97 54.1,48.26 49.66,48.26 48.1,46.7 U1.11
BST
  Top 0.254: C4.1 15.88,38.61 16.21,38.27 U2.5
D+
  Top 0.254: U1.34 35.46,42.7 34.54,41.78 34.54,13.08 40.64,6.98 USB1.3
D-
  Top 0.254: U1.33 35.2,43.2 34.04,42.04 34.04,12.7 39.99,6.75 USB1.2
ENC1A  (1 unrouted)
  Top 0.254: U1.24 38.14,52.15 32,58.29 32,60.96 28.19,64.77 24.38,64.77 22.19,66.97 J4.2
ENC1B
  Top 0.254: U1.23 38.64,52.41 32.51,58.55 32.51,61.28 26.03,67.77 J4.1
ENC2A
  Top 0.254: U1.29 34.41,45.2 32,42.8 32,33.53 31.5,33.02 24,33.02 13.81,22.83 13.81,21.44 J5.2
ENC2B
  Top 0.254: U1.30 34.67,44.7 32.51,42.55 32.51,31.75 31.12,30.35 23.14,30.35 J5.1
FB
  Top 0.254: C5.1 R2.2 13.46,40.26 R3.1 13.46,38.86 14.27,38.06 U2.8
GND  (via drill 0.35, 0.39)
  Top 0.152: 46.86,52.32 47.24,52.32
  Top 0.254: 40.77,42.2 40.8,42.2 42.3,43.7 U1.5 | 40.77,42.2 40.64,42.2 | 40.64,42.2 U1.35 | 40.64,42.2 40.64,40.95 U1.42 40.64,37.98 39.37,36.7 39.37,35.05 40.13,34.29 | 40.77,42.2 41.14,42.58 U1.18 | J14.8 J14.7 | U9.1 40.8,58.93 41.53,58.93 41.78,59.18 v41.78,59.94
  Top 0.305: U9.9 37.33,59.94 C17.1
  Top 0.406: U2.1 12.35,34.77 C3.1 11.68,35.18 6.6,40.26
  other vias: 41.78,67.44 30.73,18.41 24.51,24.51 24.38,22.73 15.49,17.14 25.4,23.62 29.08,18.16 29.97,19.18 55.88,51.31 77.72,46.74 78.23,33.53 65.15,36.96 76.2,52.32 74.17,27.94 67.18,34.54 17.14,51.56 18.8,51.69 18.03,52.45 22.1,57.4 23.11,56.52 37.21,67.56 36.07,33.15 39.12,46.23 42.8,46.23 42.8,42.67 39.12,42.67 30.35,29.08 33.27,21.34 50.8,1.52 22.1,14.99 29.84,17.53 27.94,69.6 6.6,42.16 2.54,42.16 10.67,26.42 18.41,65.66 12.19,55.25 23.37,16.26 17.27,34.54 17.65,18.92 35.05,2.03 40.51,32.77 36.07,21.34 35.05,9.65 23.62,23.5 17.91,50.8 28.7,62.48 55.5,63.5 22.86,58.17 19.05,47.12 43.18,32.77 46.48,32.77 40.51,15.37 44.7,71.63 53.85,10.67 17.27,33.53 18.29,33.53 19.3,33.53 16.26,33.53 18.29,32.51 19.3,32.51 19.3,31.5 18.29,31.5 20.32,33.53 20.32,32.51 20.32,31.5 1.52,42.16 5.08,42.16 20.32,5.59 8.13,17.27 16.26,50.8 17.02,50.04 45.72,10.16 40.51,14.48 43.18,28.58 40.64,28.58 52.32,70.1 63.5,52.83 56.39,58.42 57.91,75.18 36.58,12.7 48.77,73.15 62.87,69.09 34.54,57.91 59.94,77.22 59.94,52.83 35.56,57.91 44.7,49.78 48.77,51.82 36.07,26.42 35.56,13.72
  pour Bottom (isolate 0.305, rank 2, no thermals): 23.24,81.28 -0.13,57.4 0.02,22.99 23.5,0.02 58.04,-0.13 81.28,23.11 81.28,57.91 58.04,81.28
  pour Top (isolate 0.305, rank 2, no thermals): 23.37,81.28 0,57.4 -0.11,32.64 -0.05,23.35 23.75,0.27 58.42,0.12 81.41,23.11 81.41,57.91 58.17,81.28
  cutout Top: 25.78,48.01 25.78,45.85 26.92,45.85 26.92,48.01
  cutout Top: 43.69,11.94 43.87,11.94 43.87,11.05 43.69,11.05
  cutout Top: 41.66,6.1 41.66,9.4 41.15,9.4 41.15,6.1
  cutout Top: 38.61,60.45 40.77,60.45 40.77,58.93 38.61,58.93
  cutout Top: 34.42,57.4 34.42,56.9 36.58,56.9 36.58,57.4
  cutout Top: 40.64,58.42 42.16,58.42 42.16,57.91 40.64,57.91
  cutout Top: 40.77,26.29 42.8,26.29 42.8,26.04 42.67,25.91 40.89,25.91 40.77,26.04
MOTOR1A
  Top 0.254: U1.27 35.59,46.2 30.99,50.8 25.27,50.8 25.05,50.8 25.01,50.8 U5.3
MOTOR1B
  Top 0.254: U1.28 36.62,45.72 34.16,45.72 31.62,48.26 26.16,48.26 25.79,48.26 25.75,48.26 U5.2
MOTOR2A  (1 unrouted)
  Top 0.254: U6.3 33.02,27.77 33.02,42.42 34.8,44.2 U1.31
MOTOR2B  (1 unrouted)
  Top 0.254: U6.2 33.53,26.48 33.53,42.16 35.06,43.7 U1.32
N$1  (1 unrouted)
  Top 0.305: U6.8 25.44,16.6 24.9,16.05
  Top 0.813: 25.44,16.6 20.04,11.2 J3.1
N$2  (1 unrouted)
  Top 0.254: U6.6 23.79,18.54 23.75,18.54
  Top 0.813: J3.2 18.87,13.67 23.75,18.54
N$3  (1 unrouted)
  Top 0.305: 16.25,56 15.49,56.76
  Top 0.813: 16.25,56 11.06,61.2 J2.1
N$4
  Top 0.254: U7.4 61.56,63.66 R21.2
N$5
  Top 0.254: J15.4 J15.3
N$6
  Top 0.254: R21.1 64.01,66.55 64.01,71.27 D2.2
N$7
  Top 0.254: J10.1 52.49,17.78 42.04,17.78 40.26,19.56 R15.1
N$9
  Top 0.254: J15.8 J15.7
N$10
  Top 0.254: J8.1 63.34,25.87 56.26,18.8 46.99,18.8 46.1,19.69 R17.1
N$11
  Top 0.254: SW1.1 SW1.4 29.72,8.89 R10.1
N$12
  Top 0.254: J15.10 J15.9
N$14
  Top 0.254: C10.2 40.51,36.96 41.14,37.59 U1.43
N$15
  Top 0.254: J15.12 J15.11
N$16  (1 unrouted)
  Top 0.254: 18.07,57.78 18.03,57.78
  Top 0.813: 18.03,57.78 15.23,60.59 15.23,62.5 J2.2
N$17
  Top 0.254: R4.1 D1.+
N$18
  Top 0.254: J15.16 J15.15
N$19
  Top 0.254: R7.1 24.64,54.86 24.64,54.63 U5.4
N$20  (1 unrouted)
  Top 0.254: U6.4 26.39,25.73 26.39,28.1 R8.1
N$21
  Top 0.254: J9.1 60.54,18.29 45.09,18.29 43.31,20.07 R16.1
N$22
  Top 0.254: J15.14 J15.13
N$23  (via drill 0.35)
  Top 0.254: v14.73,39.62 14.73,38.86 15.57,38.03 U2.6 | v14.73,42.67 R1.1
  Bottom 0.254: v14.73,39.62 v14.73,42.67
N$29
  Top 0.254: C3.2 12.83,36.07 14.61,36.07 14.91,36.38 U2.7
N$42
  Top 0.254: J14.6 J14.5
N$45
  Top 0.254: J15.18 J15.17
N$46
  Top 0.254: J15.20 J15.19
N$48
  Top 0.254: J14.10 J14.9
N$49
  Top 0.254: J14.12 J14.11
N$50
  Top 0.254: J14.14 J14.13
N$51
  Top 0.254: J14.16 J14.15
N$52
  Top 0.254: J14.18 J14.17
N$53
  Top 0.254: J14.20 J14.19
N$54
  Top 0.254: J14.22 J14.21
N$55
  Top 0.254: J14.24 J14.23
N$56
  Top 0.254: J14.26 J14.25
N$57
  Top 0.254: J14.28 J14.27
N$58
  Top 0.254: J14.30 J14.29
N$59
  Top 0.254: J14.32 J14.31
NEOPIXEL
  Top 0.254: U1.15 42.64,51.15 49.91,58.42 54.74,58.42 54.98,58.42 U7.2
NEOPIXEL_OUT  (via drill 0.35)
  Top 0.254: v41.91,52.7 49.01,59.8 49.01,64.79 J11.1 54.47,70.28 57.54,73.35 D2.4
  Bottom 0.254: v41.91,52.7 33.53,52.7 32,51.18 32,33.53 31.5,33.02 29.21,33.02 J15.2
RX  (via drill 0.35)
  Top 0.254: U1.20 40.14,52.84 v47.24,59.94
  Bottom 0.254: J17.P$3 47.13,60.06 v47.24,59.94
SCL1  (via drill 0.35)
  Top 0.254: J15.21 30.73,57.15 35.05,52.83 35.05,47.51 35.86,46.7 U1.26 | R11.2 35.05,65.79 34.92,65.91
  Top 0.305: J15.21 J15.22 | J6.4 34.9,67.59 v34.92,67.56 34.92,65.91 34.92,65.79
  Bottom 0.305: v34.92,67.56 34.04,66.67 34.04,60.71 J15.21
SCL2  (via drill 0.35, 0.39)
  Top 0.254: U1.22 39.14,54.77 39.62,55.25 v39.62,55.37 U9.13 | J16.P$2 40.02,70.23 42.55,67.7 42.55,65.41 | 42.55,65.41 v42.55,58.29 | R14.2 42.55,65.41
  Bottom 0.254: v42.55,58.29 v39.62,55.37
SDA1  (via drill 0.35)
  Top 0.254: J15.23 30.48,58.93 36.64,52.76 U1.25
  Top 0.305: J15.23 J15.24 | R12.2 v32.77,67.56 32.77,71.82 33.9,72.96 J6.3
  Bottom 0.305: v32.77,67.56 32.77,61.98 J15.23
SDA2
  Top 0.254: 41.91,55.5 45.09,58.67 45.09,65.41 | 41.91,55.5 39.64,53.23 U1.21 | J16.P$3 41.27,70.36 45.09,66.54 45.09,65.41 | R13.2 45.09,65.41 | U9.14 40.12,57.28 41.91,55.5
SERVO1  (via drill 0.35)
  Top 0.254: v46.74,40.64 45.47,40.64 45.14,40.96 U1.1
  Bottom 0.254: v46.74,40.64 59.56,40.64 67.04,48.12 J12.3
SERVO2  (via drill 0.35)
  Top 0.254: U1.2 46.19,42.2 v46.74,41.66
  Bottom 0.254: v46.74,41.66 47.24,41.66 48.77,43.18 59.82,43.18 65.25,48.61 J12.6
SERVO3
  Top 0.254: U1.13 43.64,50.1 46.89,53.34 57.66,53.34 61.11,56.79 J12.9
SERVO4
  Top 0.254: U1.14 43.14,50.67 48.35,55.88 57.02,55.88 59.73,58.59 J12.12
SONAR1ECHO
  Top 0.254: U1.41 40.14,38.19 38.87,36.91 38.87,26.16 39.5,25.53 R18.1 R15.2
SONAR1TRIG
  Top 0.254: J10.2 55.88,12.57 51.18,17.27 39.62,17.27 38.35,18.54 38.35,38.35 39.14,39.14 U1.39
SONAR2ECHO
  Top 0.254: U1.47 43.14,39.15 44.32,37.97 44.45,37.85 44.45,26.16 43.81,25.53 R19.1 R16.2
SONAR2TRIG
  Top 0.254: J9.2 63.55,17.02 57.71,11.18 56.26,11.18 50.67,16.76 39.24,16.76 37.85,18.16 37.85,38.48 38.64,39.28 U1.38
SONAR3ECHO
  Top 0.254: U1.48 45.1,38.74 45.1,26.02 45.59,25.53 R20.1 R17.2
SONAR3TRIG
  Top 0.254: J8.2 69.58,16.11 61.09,7.62 58.93,7.62 50.29,16.26 38.99,16.26 37.34,17.91 37.34,39.39 U1.37
SW
  Top 0.254: 22.1,36.07 22.1,35.33 | C4.2 17.78,39.5 17.78,36.07 15.75,36.07 15.57,35.88 U2.3
  pour Top (no thermals): 16.89,38.86 17.02,38.99 18.41,38.99 20.57,36.83 23.9,36.82 24.26,36.46 24.26,34.54 24,34.29 19.05,34.29 17.65,35.69 15.82,35.69 15.7,35.56 15.57,35.56 15.44,35.69 15.44,36.27 15.62,36.45 16.51,36.45 16.89,36.83
SWCLK  (via drill 0.39)
  Top 0.254: U1.45 42.14,37.74 v42.29,37.59 | v35.69,32.26 R9.2
  Bottom 0.254: v42.29,37.59 42.29,37.21 TP2.TP 37.34,32.26 v35.69,32.26
SWDIO  (via drill 0.39)
  Top 0.254: v43.31,37.59 43.31,37.96 42.64,38.62 U1.46
  Bottom 0.254: v43.31,37.59 43.31,35.69 TP3.TP
TX
  Top 0.254: U1.19 40.64,52.33 48.42,60.1 48.42,68.58 45.88,71.12 J17.P$2
VDDANA
  Top 0.254: 48.26,36.07 48.26,33.02 FB.1 | 48.26,36.07 48.26,41.91 45.97,44.2 U1.6 | C12.2 48.26,36.07
VSENSE  (via drill 0.35)
  Top 0.254: R5.1 25.5,63.48 R6.1 25.53,62.87 26.16,62.23 26.16,53.98 26.8,53.34 31.5,53.34 v34.04,50.8 | v44.96,48.77 45.14,48.58 U1.12
  Bottom 0.254: v34.04,50.8 36.07,48.77 v44.96,48.77

### Text on the board
tNames: I2C | GPS | GND | 3.3V | COMPASS | 5V | TX | RX | MOTOR1 | A | SDA | SCL | GND | DATA | GND | 3.3V | B | 5V | NEOPIXEL | 5V | GND | SCL | SDA | GND | 4 | 3 | SERVO | 2 | 1 | SIGNAL | GND | 5V | - | + | A6 | A5 | - | A4 | 7-14V | A3 | ANALOG | A2 | SIGNAL | A1 | + | 3.3V | GND | + | B | 3.3V | A | GND | ECHO | TRIG | 5V | GND | SONAR3 | MOTOR2 | ECHO | TRIG | 5V | GND | SONAR2 | SONAR1 | RESET
bNames: RoverWing V2.0 / D. Bershadsky, A. Kirillov / github.com/roverwing